# Altium schematic sheet Part14_SPI_ST7735.SchDoc
size A4
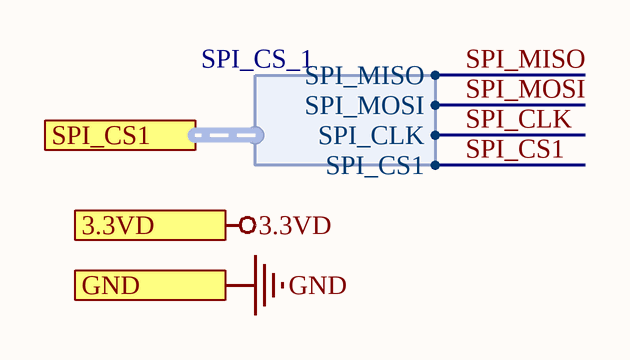
[diagram p0: Part14_SPI_ST7735.SchDoc]

## Ports
3.3VD, GND, SPI_CS1 (harness SPI_CS_1)

## Harnesses
SPI_CS_1: SPI_MISO, SPI_MOSI, SPI_CLK, SPI_CS1

## Nets
3.3VD: port 3.3VD
GND: port GND
SPI_CLK: port SPI_CS1.SPI_CLK
SPI_CS1: port SPI_CS1.SPI_CS1
SPI_MISO: port SPI_CS1.SPI_MISO
SPI_MOSI: port SPI_CS1.SPI_MOSI